# EAGLE design microusb_li_ion_charger (EAGLE 7.2.0)
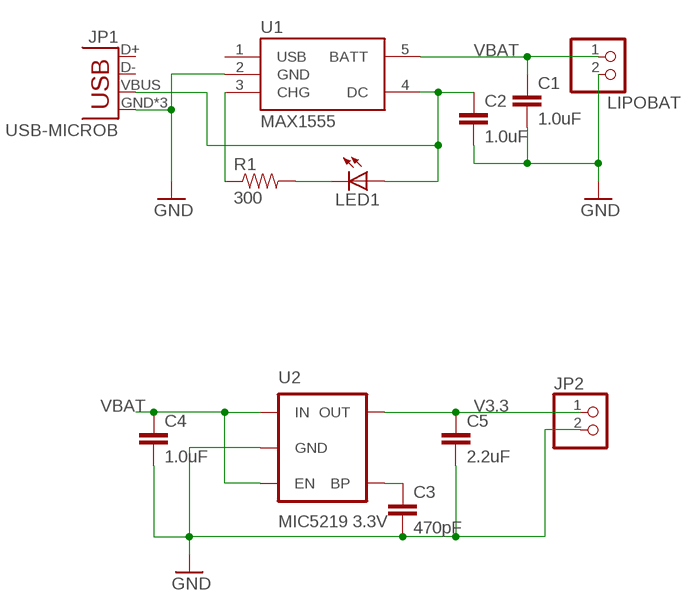
[diagram p0: schematic, sheet 1]

## Parts
C1  1.0uF  1.0UF-25V-+80/-20(0805)  [0805]
C2  1.0uF  1.0UF-25V-+80/-20(0805)  [0805]
C3  470pF  1.0UF-25V-+80/-20(0805)  [0805]
C4  1.0uF  1.0UF-25V-+80/-20(0805)  [0805]
C5  2.2uF  1.0UF-25V-+80/-20(0805)  [0805]
JP1  USB-MICROB  [USB-MICROB]
JP2  PINHD-1X2  [1X02]
LED1  LEDCHIP-LED0805  [CHIP-LED0805]
LIPOBAT  JST_2PIN-SMT  [JST-PH-2-SMT]
R1  300  RESISTOR0805-RES  [0805]
U1  MAX1555  [SOT23-5]
U2  MIC5219 3.3V  V_REG_MIC52193.3V  [SOT23-5]

## Nets
GND: C1.2 C2.2 C3.2 C4.2 C5.2 JP1.GND JP1.MT1(GND) JP1.MT2(GND) JP2.2 LIPOBAT.2 U1.2(GND) U2.2(GND)
N$1: C2.1 JP1.VBUS LED1.A U1.4(DC)
N$3: R1.1 U1.3(CHG)
N$4: LED1.C R1.2
N$5: C3.1 U2.4(BP)
V3.3: C5.1 JP2.1 U2.5(OUT)
VBAT: C1.1 C4.1 LIPOBAT.1 U1.5(BATT) U2.1(IN) U2.3(EN)
Unconnected: JP1.D+ JP1.D- U1.1(USB)

## Library data of the parts
C1 C2 C4 = SparkFun-Capacitors:1.0UF-25V-+80/-20(0805): CAP-11625; PROD_ID: CAP-11625
C3 C5 = SparkFun-Capacitors:1.0UF-25V-+80/-20(0805): CAP-11625; PROD_ID: CAP-11625; VALUE: 1.0uF
JP1 = SparkFun-Connectors:USB: USB Connectors USB-B-PTH is fully proven SKU : PRT-00139/CONN-08278 USB-miniB is fully proven SKU : PRT-00587 USB-A-PCB is untested. USB-A-H is throughly reviewed, but untested. Spark Fun Electronics SKU : PRT-00437 USB-B-SMT is throughly reviewed, but untested. Needs silkscreen touching up. USB-A-S has not been used/tested USB-MB-H has not been used/tested USB-MICROB has been used. CONN-09505; PROD_ID: CONN-09505
JP2 = pinhead:PINHD-1X2: PIN HEADER
LED1 = led:LED: LED OSRAM: - CHIPLED LG R971, LG N971, LY N971, LG Q971, LY Q971, LO R971, LY R971 LH N974, LH R974 LS Q976, LO Q976, LY Q976 LO Q996 - Hyper CHIPLED LW Q18S LB Q993, LB Q99A, LB R99A - SideLED LS A670, LO A670, LY A670, LG A670, LP A670 LB A673, LV A673, LT A673, LW A673 LH A674 LY A675 LS A676, LA A676, LO A676, LY A676, LW A676 LS A679, LY A679, LG A679 - Hyper Micro SIDELED® LS Y876, LA Y876, LO Y876, LY Y876 LT Y87S - SmartLED LW L88C, LW L88S LB L89C, LB L89S, LG L890 LS L89K, LO L89K, LY L89K LS L896, LA L896, LO L896, LY L896 - TOPLED LS T670, LO T670, LY T670, LG T670, LP T670 LSG T670, LSP T670, LSY T670, LOP T670, LYG T670 LG T671, LOG T671, LSG T671 LB T673, LV T673, LT T673, LW T673 LH T674 LS T676, LA T676, LO T676, LY T676, LB T676, LH T676, LSB T676, LW T676 LB T67C, LV T67C, LT T67C, LS T67K, LO T67K, LY T67K, LW E67C LS E67B, LA E67B, LO E67B, LY E67B, LB E67C, LV E67C, LT E67C LW T67C LS T679, LY T679, LG T679 LS T770, LO T770, LY T770, LG T770, LP T770 LB T773, LV T773, LT T773, LW T773 LH T774 LS E675, LA E675, LY E675, LS T675 LS T776, LA T776, LO T776, LY T776, LB T776 LHGB T686 LT T68C, LB T68C - Hyper Mini TOPLED® LB M676 - Mini TOPLED Santana® LG M470 LS M47K, LO M47K, LY M47K Source: http://www.osram.convergy.de LUXEON: - LUMILED® LXK2-PW12-R00, LXK2-PW12-S00, LXK2-PW14-U00, LXK2-PW14-V00 LXK2-PM12-R00, LXK2-PM12-S00, LXK2-PM14-U00 LXK2-PE12-Q00, LXK2-PE12-R00, LXK2-PE12-S00, LXK2-PE14-T00, LXK2-PE14-U00 LXK2-PB12-K00, LXK2-PB12-L00, LXK2-PB12-M00, LXK2-PB14-N00, LXK2-PB14-P00, LXK2-PB14-Q00 LXK2-PR12-L00, LXK2-PR12-M00, LXK2-PR14-Q00, LXK2-PR14-R00 LXK2-PD12-Q00, LXK2-PD12-R00, LXK2-PD12-S00 LXK2-PH12-R00, LXK2-PH12-S00 LXK2-PL12-P00, LXK2-PL12-Q00, LXK2-PL12-R00 Source: www.luxeon.com KINGBRIGHT: KA-3528ASYC Source: www.kingbright.com
LIPOBAT = adafruit:JST_2PIN: JST 2-Pin Connectors of various flavors SMT-RA (S2B-PH-SM4) 4UConnector #17311 SMT (B2B-PH-SM4) THM-RA (S2B-PH) THM (B2B-PH)
R1 = SparkFun-Resistors:RESISTOR: Resistor Basic schematic elements and footprints for 0603, 1206, and PTH resistors.
U1 = SparkFun-PowerIC:MAX1555: MAX1555 Lithium Charger IC SOT-23 Lithium Polymer charging IC. Schematic element and footprint proven. Spark Fun Electronics SKU : COM-00674
U2 = SparkFun-PowerIC:V_REG_MIC5219: V_REG MIC5219 Standard 3.3V and 5V 500mA LDO voltage regulator in SOT-23 layout. Micrel part MIC5219. BP (by-pass) pin is used to lower output noise with 470pF cap, may be left open.; PROD_ID: VREG-09872

## Board
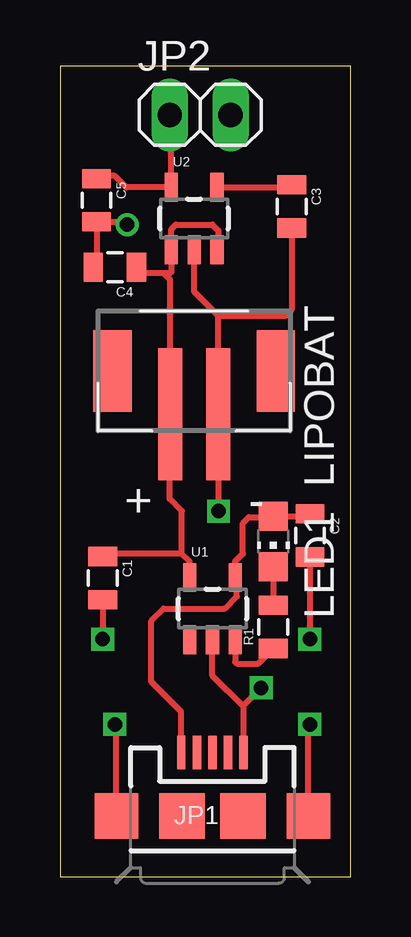
[diagram p1: board, top side]
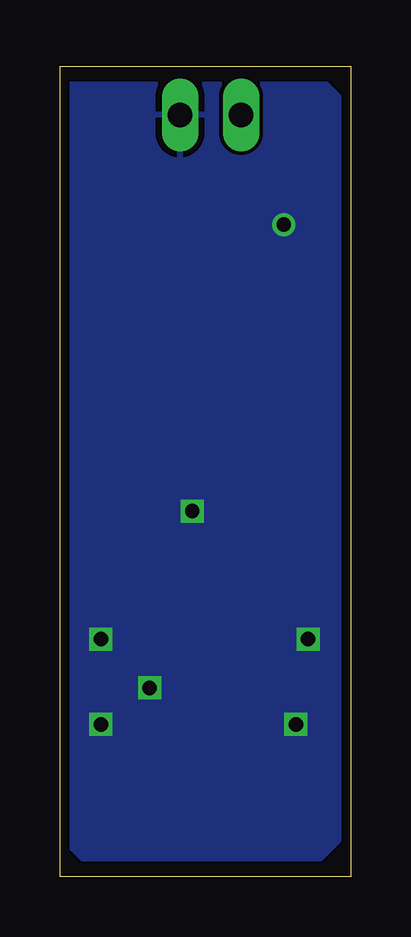
[diagram p2: board, bottom side, seen from below]

Size 12.12 x 33.77 mm. Coordinates in mm from the lower left corner, seen from the top.
Outline: 0,0 12.12,0 12.12,33.77 0,33.77 0,0
Copper layers (1*16): Top 0.0356mm / dielectric 1.5011mm / Bottom 0.0356mm
Design rules "LaenPCBOrder": minimum track width 6mil, minimum drill 13mil, track to track 6mil, track to pad 6mil, pad to pad 6mil, via to via 6mil, smd to smd 6mil, copper to edge 15mil, drill to drill 6mil, minimum pad ring 7mil, minimum via ring 7mil, stop-mask expansion 3mil, vias tented up to drill 0mil, thermal gap 10mil

### Footprints (pad centres in the part's own frame; a part is rotated, then mirrored left to right if it is on the bottom)
0805 = smd 0.8 x 1.2: 1 -0.9,0; 2 0.9,0
USB-MICROB = smd 0.35 x 1.4: D+ 0,2.65; D- -0.65,2.65; GND 1.3,2.65; ID 0.65,2.65; VBUS -1.3,2.65 | smd 1.8 x 1.9: MT1 -4,0; MT2 4,0 | smd 1.9 x 1.9: P$1 -1.27,0; P$2 1.27,0
1X02 = drill 1.016 long: 1 -1.27,0; 2 1.27,0
CHIP-LED0805 = smd 1.2 x 1.2: A 0,-1.05; C 0,1.05
JST-PH-2-SMT = smd 1 x 5.5: 1 -1,-1.8; 2 1,-1.8 | smd 1.6 x 3.4: NC1 -3.4,0; NC2 3.4,0
SOT23-5 = smd 0.55 x 1.2: 1 -0.95,-1.3; 2 0,-1.3; 3 0.95,-1.3; 4 0.95,1.3; 5 -0.95,1.3

### Placement (x,y rotation side)
C1  1.78,12.45 270 top
C2  10.41,14.22 270 top
C3  9.65,27.94 270 top
C4  2.29,25.4 180 top
C5  1.52,28.19 270 top
JP1  6.35,2.54 0 top
JP2  5.84,31.75 0 top
LED1  8.89,13.97 180 top
LIPOBAT  5.59,21.08 0 top
R1  8.89,10.41 90 top
U1  6.35,11.18 0 top
U2  5.59,27.43 0 top

### Tracks (layer width: path | path; a pad name or v marks a point on that pad's centre or on a via)
GND  (via drill 0.6)
  Top 0.254: JP1.GND 7.65,7.08 | 7.65,7.08 6.35,8.38 U1.2 | C1.2 v1.78,9.91 | C2.2 v10.41,9.91 | v6.6,15.24 6.59,15.26 LIPOBAT.2 6.59,23.38 | JP1.MT2 10.35,6.29 v10.41,6.35 | JP1.MT1 2.35,6.29 v2.29,6.35 | 7.65,7.08 7.65,7.14 v8.38,7.87 | 6.59,23.38 5.59,24.38 U2.2 | C3.2 9.65,23.62 9.4,23.37 6.6,23.37 6.59,23.38 | C4.2 1.52,25.54 C5.2 2.68,27.29 v2.79,27.18
  pour Bottom: 0.51,1.52 1.27,0.76 11.18,0.76 11.68,1.27 11.68,33.02 1.02,33.02 0.51,32.51
N$1
  Top 0.254: JP1.VBUS 5.05,6.89 3.81,8.13 3.81,10.67 4.32,11.18 6.86,11.18 7.37,11.68 7.37,12.41 U1.4 7.3,13.14 7.62,13.46 7.62,14.73 7.87,14.99 8.86,14.99 LED1.A 10.31,15.02 C2.1
N$3
  Top 0.254: U1.3 7.3,8.96 7.37,8.89 8.27,8.89 R1.1
N$4
  Top 0.254: LED1.C R1.2
N$5
  Top 0.254: U2.4 9.54,28.73 C3.1
V3.3
  Top 0.254: JP2.1 4.64,31.68 U2.5 2.76,28.73 2.29,29.21 1.64,29.21 C5.1
VBAT
  Top 0.254: U1.5 5.4,13.14 5.08,13.46 | 5.08,13.46 1.89,13.46 C1.1 | 5.08,13.46 5.08,15.24 4.57,15.75 4.57,19.27 LIPOBAT.1 4.59,24.88 4.32,25.15 | 4.32,25.15 4.57,25.15 4.64,25.21 U2.1 4.64,26.99 4.83,27.18 6.35,27.18 6.6,26.92 6.6,26.2 U2.3 | 4.32,25.15 3.44,25.15 C4.1